# Altium project LC Circuit.PrjPcb
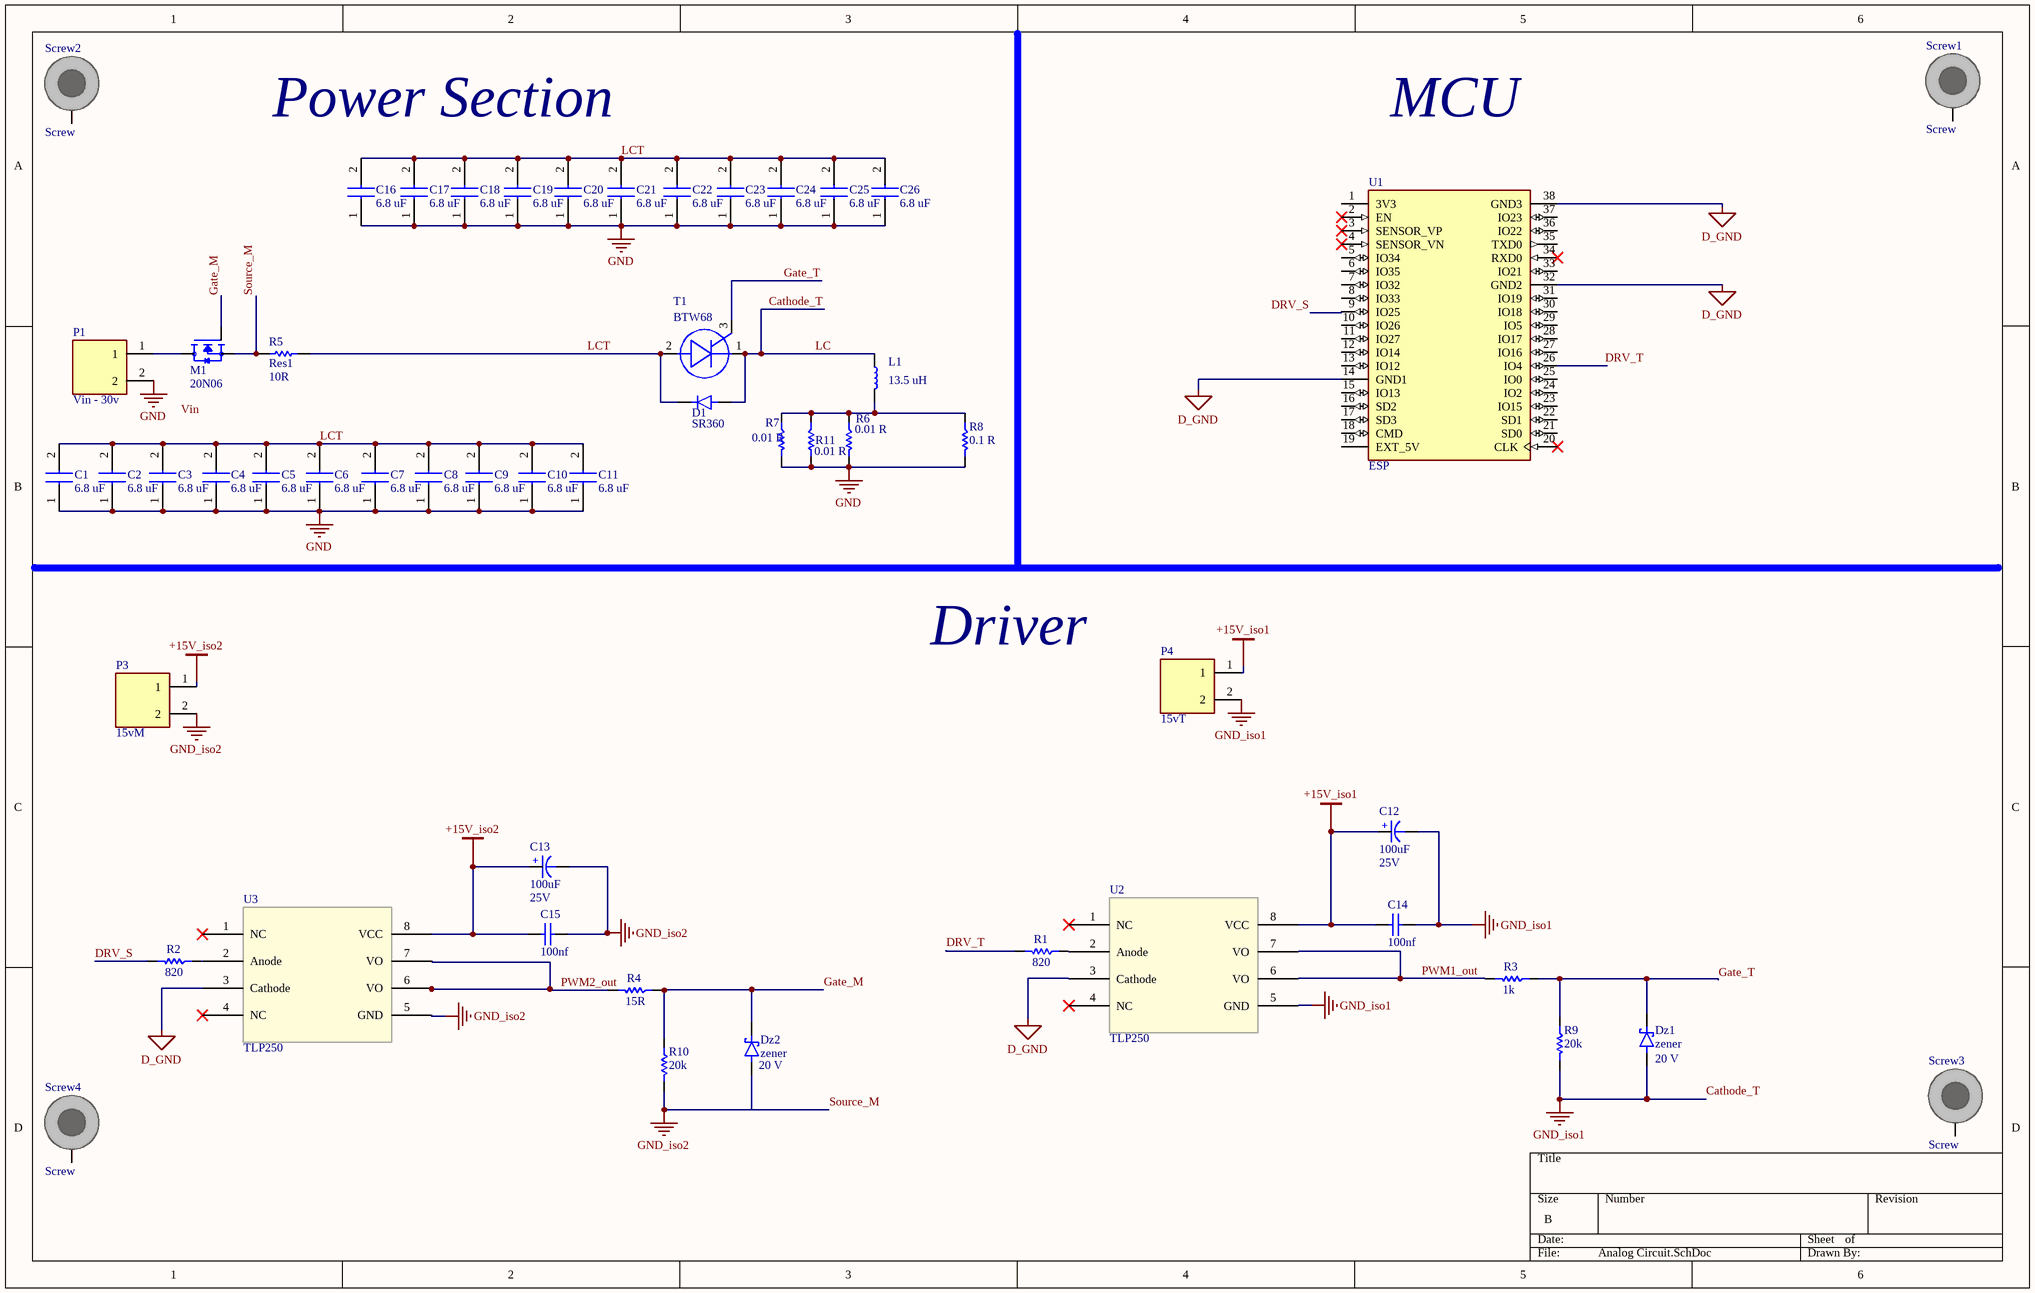
[diagram p0: Analog Circuit.SchDoc]
1 sheet, 53 parts. Net scope: global (net labels, ports and power ports of the same name join across sheets).
Board file: Analog Circuit.PcbDoc

## Sheet Analog Circuit.SchDoc
size B; SheetNumber: 1; SheetTotal: 1

### Parts
C1  6.8 uF  [63V MKT]
C2  6.8 uF  [63V MKT]
C3  6.8 uF  [63V MKT]
C4  6.8 uF  [63V MKT]
C5  6.8 uF  [63V MKT]
C6  6.8 uF  [63V MKT]
C7  6.8 uF  [63V MKT]
C8  6.8 uF  [63V MKT]
C9  6.8 uF  [63V MKT]
C10  6.8 uF  [63V MKT]
C11  6.8 uF  [63V MKT]
C12  Voltage: 25V  [Cap 100uF]  (hidden comment: 100uF)
C13  Voltage: 25V  [Cap 100uF]  (hidden comment: 100uF)
C14  100nf  [Cap 1210]
C15  100nf  [Cap 1210]
C16  6.8 uF  [63V MKT]
C17  6.8 uF  [63V MKT]
C18  6.8 uF  [63V MKT]
C19  6.8 uF  [63V MKT]
C20  6.8 uF  [63V MKT]
C21  6.8 uF  [63V MKT]
C22  6.8 uF  [63V MKT]
C23  6.8 uF  [63V MKT]
C24  6.8 uF  [63V MKT]
C25  6.8 uF  [63V MKT]
C26  6.8 uF  [63V MKT]
D1  SR360  [SR360]
Dz1  zener  Vz: 20 V  [zener]
Dz2  zener  Vz: 20 V  [zener]
L1  13.5 uH  [Inductor]
M1  20N06  [20N06]
P1  Vin - 30v  [Connector]
P3  15vM  [Connector]
P4  15vT  [Connector]
R1  820  [Res DIP]
R2  820  [Res DIP]
R3  1k  [Res DIP]
R4  15R  [Res DIP]
R5  Res1  value 10R  [Res DIP]
R6  0.01 R  [Res 2512]
R7  0.01 R  [Res 2512]
R8  0.1 R  [Res DIP]
R9  20k  [Res DIP]
R10  20k  [Res DIP]
R11  0.01 R  [Res 2512]
Screw1  Screw  [Screw]
Screw2  Screw  [Screw]
Screw3  Screw  [Screw]
Screw4  Screw  [Screw]
T1  BTW68  [BTW68]
U1  ESP  [ESP]
U2  TLP250  [TLP250]
U3  TLP250  [TLP250]

### Nets
+15V_iso1: C12.1(+) C14.2 P4.1 U2.8(VCC)
+15V_iso2: C13.1(+) C15.2 P3.1 U3.8(VCC)
Cathode_T: C12.2(-) C14.1 D1.A Dz1.2(A) L1.1 P4.2 R9.2 T1.1(K) U2.5(GND)  [also labelled GND_iso1, LC]
D_GND: U1.14(GND1) U1.32(GND2) U1.38(GND3) U2.3(Cathode) U3.3(Cathode)
GND: C1.1 C2.1 C3.1 C4.1 C5.1 C6.1 C7.1 C8.1 C9.1 C10.1 C11.1 C16.1 C17.1 C18.1 C19.1 C20.1 C21.1 C22.1 C23.1 C24.1 C25.1 C26.1 P1.2 R6.2 R7.2 R8.2 R11.2
Source_M: C13.2(-) C15.1 Dz2.2(A) M1.2(S) P3.2 R5.2 R10.2 U3.5(GND)  [also labelled GND_iso2]
DRV_S: R2.2 U1.9(IO25)
DRV_T: R1.2 U1.26(IO4)
Gate_M: Dz2.1(K) M1.1(G) R4.1 R10.1
Gate_T: Dz1.1(K) R3.1 R9.1 T1.3(G)
LCT: C1.2 C2.2 C3.2 C4.2 C5.2 C6.2 C7.2 C8.2 C9.2 C10.2 C11.2 C16.2 C17.2 C18.2 C19.2 C20.2 C21.2 C22.2 C23.2 C24.2 C25.2 C26.2 D1.K R5.1 T1.2(A)
PWM1_out: R3.2 U2.6(VO) U2.7(VO)
PWM2_out: R4.2 U3.6(VO) U3.7(VO)
NetL1_2: L1.2 R6.1 R7.1 R8.1 R11.1
NetM1_3: M1.3(D) P1.1
NetR1_1: R1.1 U2.2(Anode)
NetR2_1: R2.1 U3.2(Anode)

Not connected (* = marked no-connect by the designer): Screw1 1; Screw2 1; Screw3 1; Screw4 1; U1 1(3V3) 2(EN)* 3(SENSOR_VP)* 4(SENSOR_VN)* 5(IO34) 6(IO35) 7(IO32) 8(IO33) 10(IO26) 11(IO27) 12(IO14) 13(IO12) 15(IO13) 16(SD2) 17(SD3) 18(CMD) 19(EXT_5V) 20(CLK)* 21(SD0) 22(SD1) 23(IO15) 24(IO2) 25(IO0) 27(IO16) 28(IO17) 29(IO5) 30(IO18) 31(IO19) 33(IO21) 34(RXD0)* 35(TXD0) 36(IO22) 37(IO23); U2 1(NC)* 4(NC)*; U3 1(NC)* 4(NC)*

### Notes on the sheet
- Power Section
- MCU
- Driver
- Labels drawn without touching a wire or pin: Vin

### Library data of the parts
C1-C11 C16-C26 = 6.8uF Cap MKT: Value: 6.8 uF
C12 C13 = Cap-Polar: Polar Capacitor; Designer: Saeid Jorablo; Organazation: ControTec; Adding Date: 1387/12/20; Value: 100uF
C14 C15 = CAP SMD 0805: CAP 0805; Designer: Abbas Basereh; Desc.: CAP SMD 0805; Data: 16-12-2016
D1 = K16
L1 = 0805 inductor: 10uH
P1 P3 P4 = Connector
R1-R4 R8-R10 = Resistor: Tolerance: 5%; Power: 1/8 W
  R1 R2: Value: 820
  R3: Value: 1k
  R4: Value: 15R
  R8: Value: 0.1 R
  R9 R10: Value: 20k
R5 = Res1: Resistor; Published: 8-Jun-2000; LatestRevisionDate: 17-Jul-2002; LatestRevisionNote: Re-released for DXP Platform.; PackageReference: AXIAL-0.3; Publisher: Altium Limited; PackageDescription: Axial Device, Thru-Hole; 2 Leads; 0.3 in Pin Spacing
R6 R7 R11 = Resistor: Resistor 2512 SMD; Tolerance: 5%; Power: 1/8 W; Value: 0.01 R